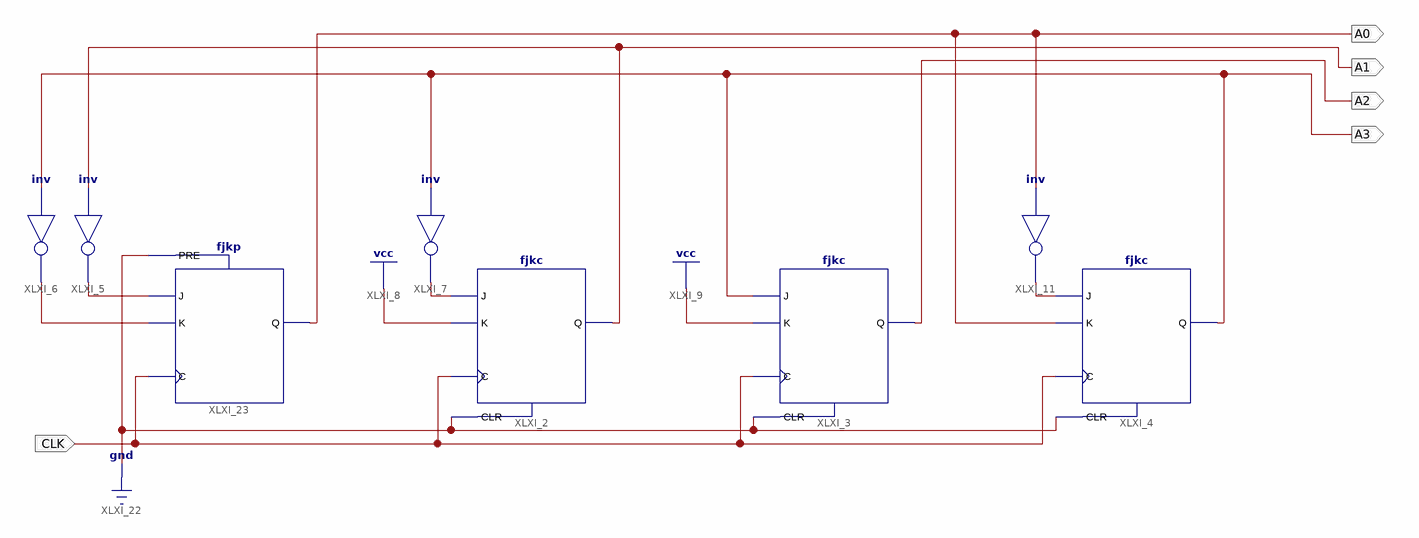
[diagram p0: schematic sheet 1]
// Xilinx ISE schematic counter128d.sch (spartan6) as structural Verilog: 8 symbols, 5 ports
module counter128d (
  input  CLK,
  output A1,
  output A3,
  output A0,
  output A2
);

  wire XLXN_1, XLXN_3, XLXN_4, XLXN_8;

  fjkc XLXI_2 (.C(CLK), .CLR(1'b0), .J(XLXN_4), .K(1'b1), .Q(A1));
  fjkc XLXI_3 (.C(CLK), .CLR(1'b0), .J(A3), .K(1'b1), .Q(A2));
  fjkc XLXI_4 (.C(CLK), .CLR(1'b0), .J(XLXN_8), .K(A0), .Q(A3));
  not XLXI_5 (XLXN_1, A1);
  not XLXI_6 (XLXN_3, A3);
  not XLXI_7 (XLXN_4, A3);
  not XLXI_11 (XLXN_8, A0);
  fjkp XLXI_23 (.C(CLK), .J(XLXN_1), .K(XLXN_3), .PRE(1'b0), .Q(A0));
endmodule
